# EAGLE design solenoid (EAGLE 9.6.2)
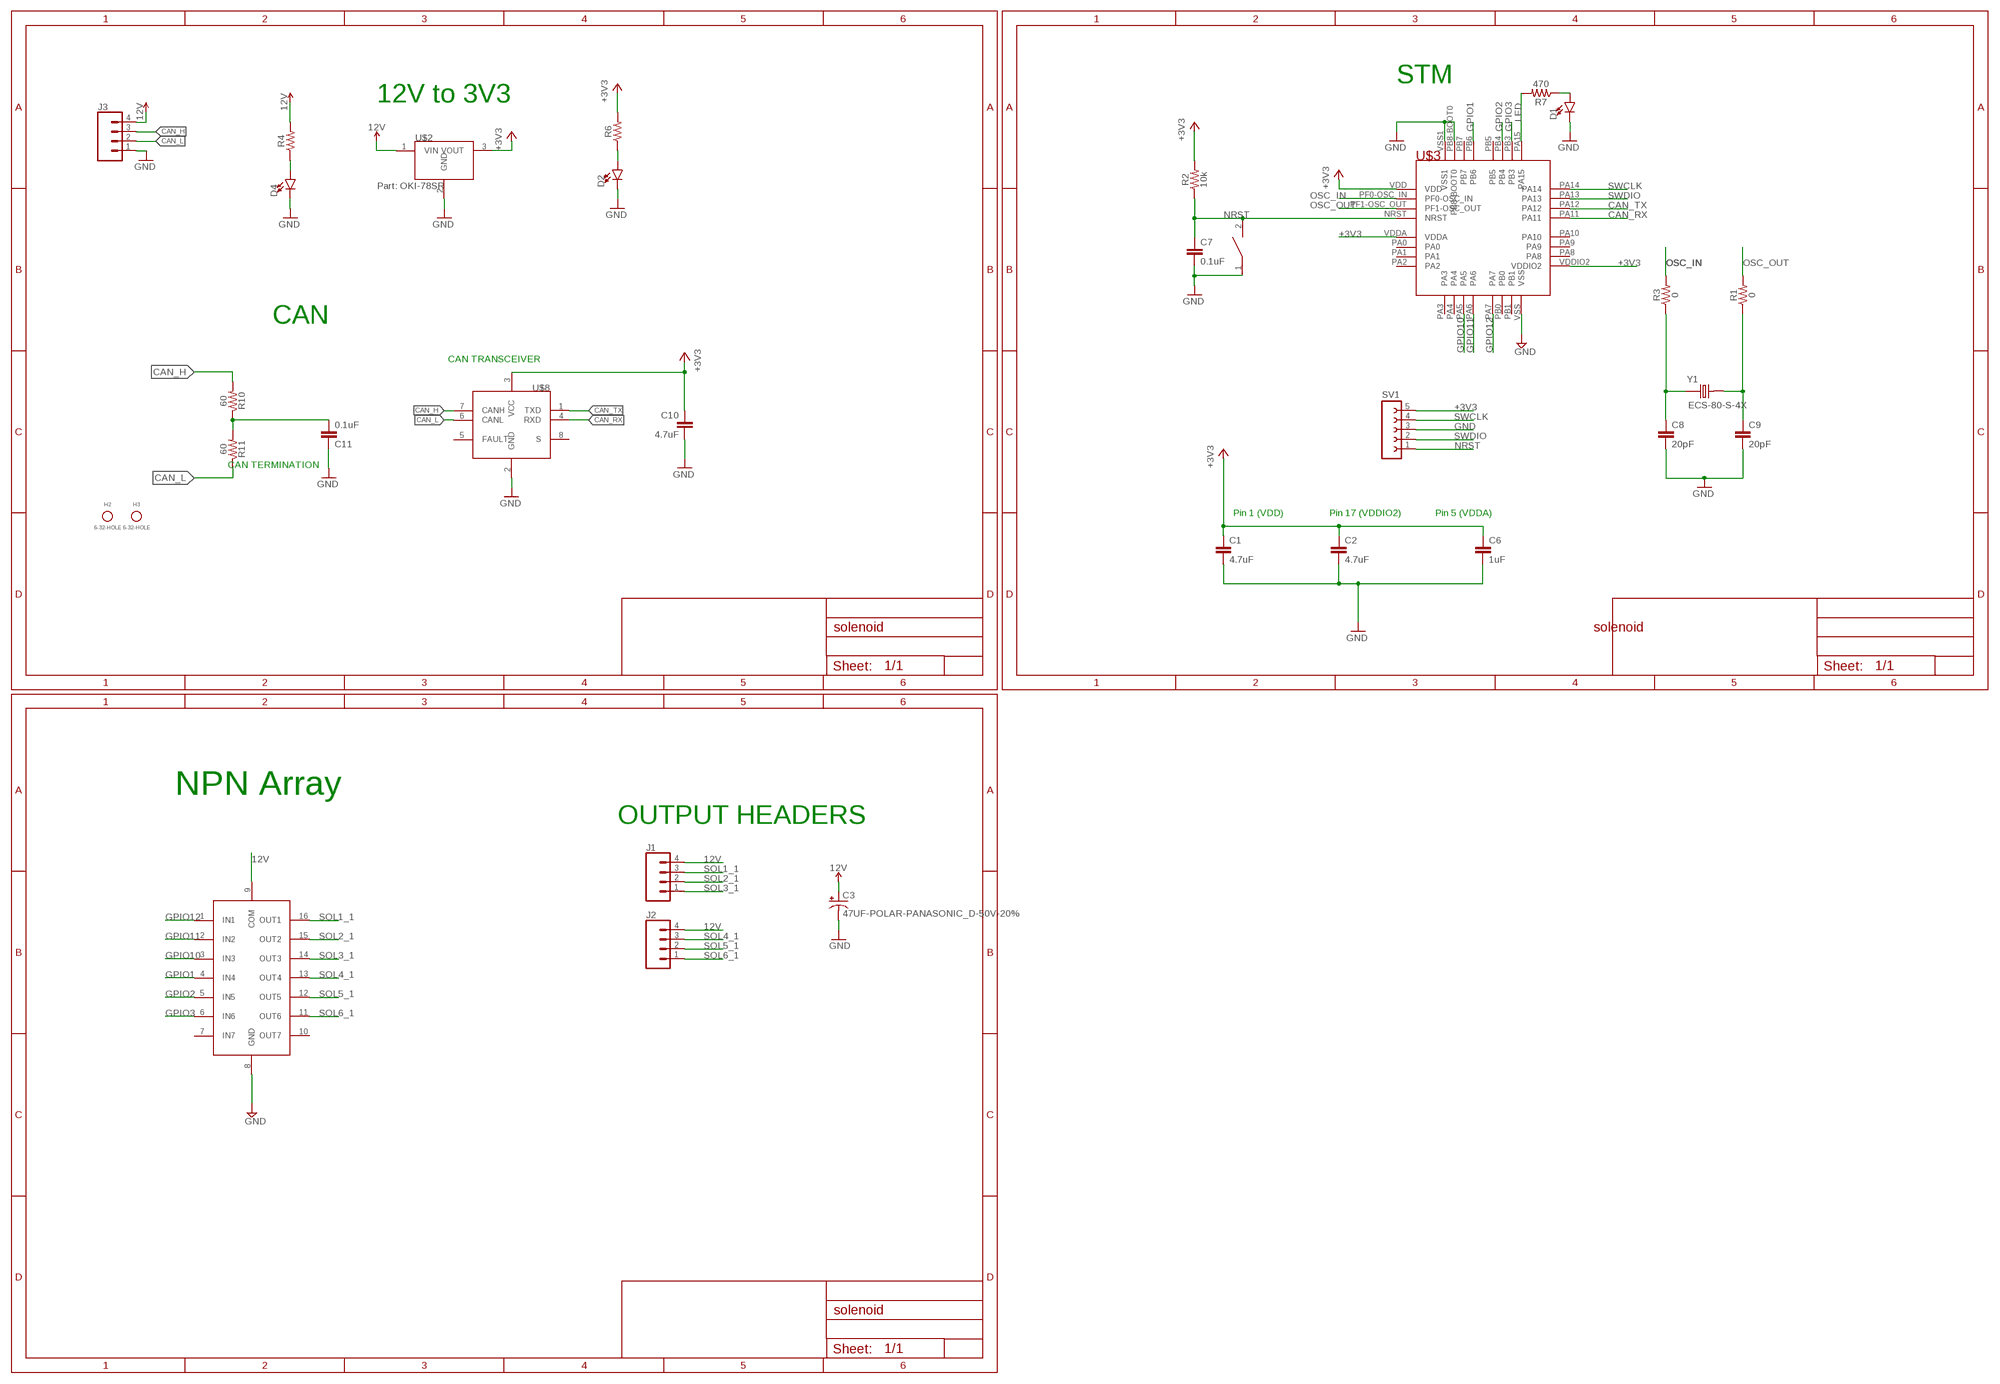
[diagram p0: schematic, sheet 1]

## Parts
C1  4.7uF  4.7UF0603  [0603]
C2  4.7uF  4.7UF0603  [0603]
C3  47UF-POLAR-PANASONIC_D-50V-20%  [PANASONIC_D]
C6  1uF  4.7UF0603  [0603]
C7  0.1uF  4.7UF0603  [0603]
C8  20pF  4.7UF0603  [0603]
C9  20pF  4.7UF0603  [0603]
C10  4.7uF  4.7UF0603  [0603]
C11  0.1uF  0.1UF-0603-25V-(+80/-20%)  [0603]
D1  LED0603  [LED-0603]
D2  LED0603  [LED-0603]
D4  LED0603  [LED-0603]
H2  6-32-HOLE  [6-32-HOLE]
H3  6-32-HOLE  [6-32-HOLE]
J1  PXC-PTSM-04-V-1778573  [PXC-PTSM-04-V-1778573]
J2  PXC-PTSM-04-V-1778573  [PXC-PTSM-04-V-1778573]
J3  PXC-PTSM-04-V-1778573  [PXC-PTSM-04-V-1778573]
R1  0  1KOHM-0603-1/10W-1%  [0603]
R2  10k  1KOHM-0603-1/10W-1%  [0603]
R3  0  1KOHM-0603-1/10W-1%  [0603]
R4  RESISTOR0603  [0603]
R6  RESISTOR0603  [0603]
R7  470  RESISTOR0603  [0603]
R10  60  1KOHM-0603-1/10W-1%  [0603]
R11  60  1KOHM-0603-1/10W-1%  [0603]
SV1  FE05-1  [FE05-1]
U1  ULN2003V12  [ULN2003V12]
U$1  DISCRETECOMPONENTS_SWITCH  [DISCRETECOMPONENTS_SW_2512]
U$2  MURATA-DC-DC  [MURATA-DC-DC]
U$3  STM32F042K6T6  [STM32F042K6T6]
U$8  TCAN337D  [SOIC-8]
Y1  ECS-80-S-4X  [XTAL_ECS-80-S-4X]

## Nets
12V: C3.+ J1.4 J2.4 J3.4 R4.2 U1.9(COM) U$2.1(VIN)
+3V3: C1.1 C2.1 C6.1 C10.1 R2.2 R6.2 SV1.5 U$2.3(VOUT) U$3.VDD U$3.VDDA U$3.VDDIO2 U$8.3(VCC)
CAN_H: J3.3 R10.2 U$8.7(CANH)
CAN_L: J3.2 R11.1 U$8.6(CANL)
CAN_RX: U$3.PA11 U$8.4(RXD)
CAN_TX: U$3.PA12 U$8.1(TXD)
GND: C1.2 C2.2 C3.- C6.2 C7.2 C8.2 C9.2 C10.2 C11.1 D1.C D2.C D4.C J3.1 SV1.3 U1.8(GND) U$1.1 U$2.2(GND) U$3.PB8-BOOT0 U$3.VSS U$3.VSS1 U$8.2(GND)
GPIO1: U1.4(IN4) U$3.PB6
GPIO2: U1.5(IN5) U$3.PB4
GPIO3: U1.6(IN6) U$3.PB3
GPIO10: U1.3(IN3) U$3.PA5
GPIO11: U1.2(IN2) U$3.PA6
GPIO12: U1.1(IN1) U$3.PA7
LED: R7.2 U$3.PA15
N$1: C9.1 R1.1 Y1.2
N$2: C8.1 R3.1 Y1.1
N$5: C11.2 R10.1 R11.2
N$24: D1.A R7.1
N$25: D4.A R4.1
N$27: D2.A R6.1
NRST: C7.1 R2.1 SV1.1 U$1.2 U$3.NRST
OSC_IN: R3.2 U$3.PF0-OSC_IN
OSC_OUT: R1.2 U$3.PF1-OSC_OUT
SOL1_1: J1.3 U1.16(OUT1)
SOL2_1: J1.2 U1.15(OUT2)
SOL3_1: J1.1 U1.14(OUT3)
SOL4_1: J2.3 U1.13(OUT4)
SOL5_1: J2.2 U1.12(OUT5)
SOL6_1: J2.1 U1.11(OUT6)
SWCLK: SV1.4 U$3.PA14
SWDIO: SV1.2 U$3.PA13
Unconnected: U1.7(IN7) U1.10(OUT7) U$3.PA0 U$3.PA1 U$3.PA2 U$3.PA3 U$3.PA4 U$3.PA8 U$3.PA9 U$3.PA10 U$3.PB0 U$3.PB1 U$3.PB5 U$3.PB7 U$8.5(FAULT) U$8.8(S)

## Notes on the sheet
- STM
- 12V to 3V3
- CAN
- CAN TRANSCEIVER
- CAN TERMINATION
- Pin 1 (VDD) | Pin 17 (VDDIO2) | Pin 5 (VDDA)
- NPN Array
- OUTPUT HEADERS

## Library data of the parts
C1 C2 C10 = SparkFun-Capacitors:4.7UF: 4.7µF ceramic capacitors A capacitor is a passive two-terminal electrical component used to store electrical energy temporarily in an electric field.; PROD_ID: CAP-08280
C3 = Panasonic 47 uF cap - EEE-1CA470SP:47UF-POLAR: 47µF polarized capacitors A capacitor is a passive two-terminal electrical component used to store electrical energy temporarily in an electric field.
C6-C9 = SparkFun-Capacitors:4.7UF: 4.7µF ceramic capacitors A capacitor is a passive two-terminal electrical component used to store electrical energy temporarily in an electric field.; PROD_ID: CAP-08280; VALUE: 4.7uF
C11 = SparkFun-Capacitors:0.1UF: 0.1µF ceramic capacitors A capacitor is a passive two-terminal electrical component used to store electrical energy temporarily in an electric field.; PROD_ID: CAP-00810
D1 D2 D4 = SparkFun-LED:LED: LED (Generic) Standard schematic elements and footprints for 5mm, 3mm, 1206, and 0603 sized LEDs. Generic LEDs with no color specified.
H2 H3 = Mounting Holes:6-32-HOLE
J1-J3 = Phoenix Contact PTSM-04-V-1778573:PXC-PTSM-04-V-1778573
R1-R3 R10 R11 = SparkFun-Resistors:1KOHM: 1kΩ resistor A resistor is a passive two-terminal electrical component that implements electrical resistance as a circuit element. Resistors act to reduce current flow, and, at the same time, act to lower voltage levels within circuits. - Wikipedia; PROD_ID: RES-07856; VALUE: 1k
R4 R6 R7 = SparkFun-Resistors:RESISTOR: Generic Resistor Package
SV1 = con-lsta:FE05-1: FEMALE HEADER; OC_FARNELL: unknown; OC_NEWARK: unknown
U1 = ULN2003V12:ULN2003V12; A1_MIN: 0.25; A_MAX: 1.75; A_MIN: 1.75; A_NOM: 1.75; B_MAX: 0.51; B_MIN: 0.33; B_NOM: 0.42; D2_MAX: 0.0; D_MAX: 10.0; D_MIN: 9.8; D_NOM: 9.9; E1_MAX: 4.0; E1_MIN: 3.8; E1_NOM: 3.9; E2_MAX: 0.0; ENOM: 1.27; E_MAX: 6.2; E_MIN: 5.8; E_NOM: 6.0; L_MAX: 1.27; L_MIN: 0.38; L_NOM: 0.825; MANUFACTURER: Diodes Inc.; PIN_COUNT: 16.0; SNAPEDA_PACKAGE_ID: 27538; STANDARD: IPC 7351B
U$1 = Push button - FSM2JMTR:DISCRETECOMPONENTS_SWITCH
U$2 = MURATA_3pin_dcdc:MURATA-DC-DC
U$3 = PI_Shield_Library:STM32F042K6T6
U$8 = STM and CAN parts:TCAN337D
Y1 = ECS-80-S-4X:ECS-80-S-4X: CRYSTAL T/H; DESCRIPTION: Crystal 8MHz Series 2-Pin HC-49/U; DIGI-KEY_PART_NUMBER: X1057-ND; DIGI-KEY_PURCHASE_URL: https://www.digikey.com/product-detail/en/ecs-inc/ECS-80-S-4X/X1057-ND/827549?utm_source=snapeda&utm_medium=aggregator&utm_campaign=symbol; MF: ECS International; MP: ECS-80-S-4X; PACKAGE: HC-49/US ECS International

## Board
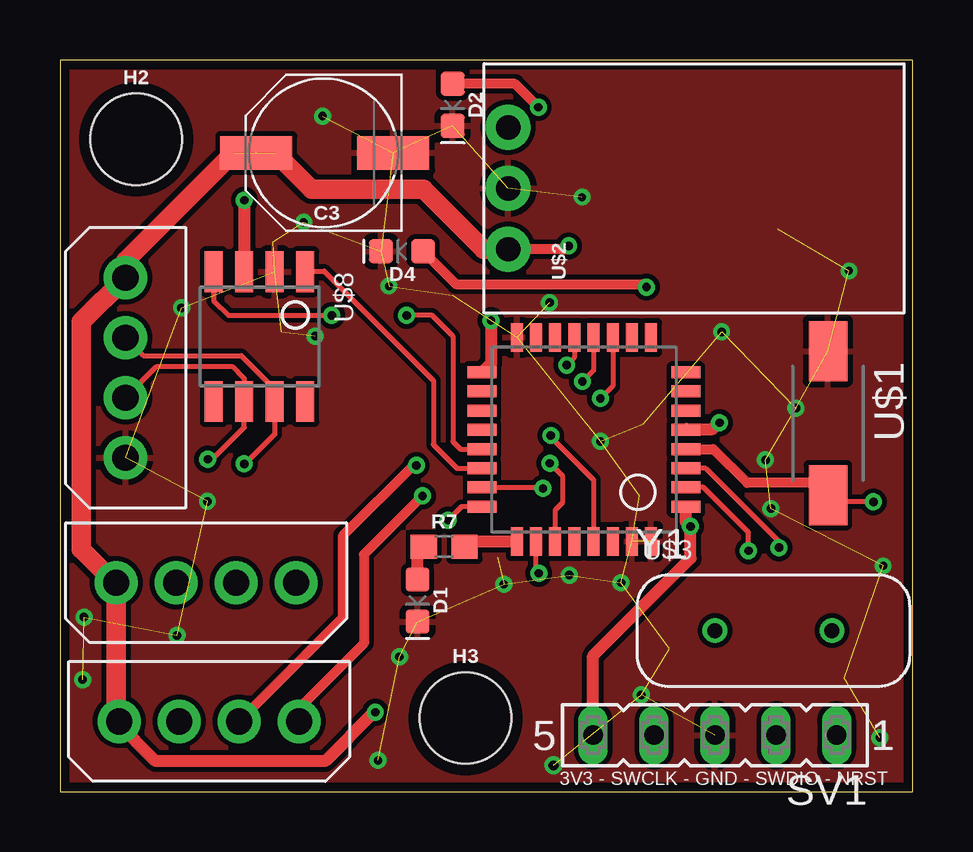
[diagram p1: board, top side]
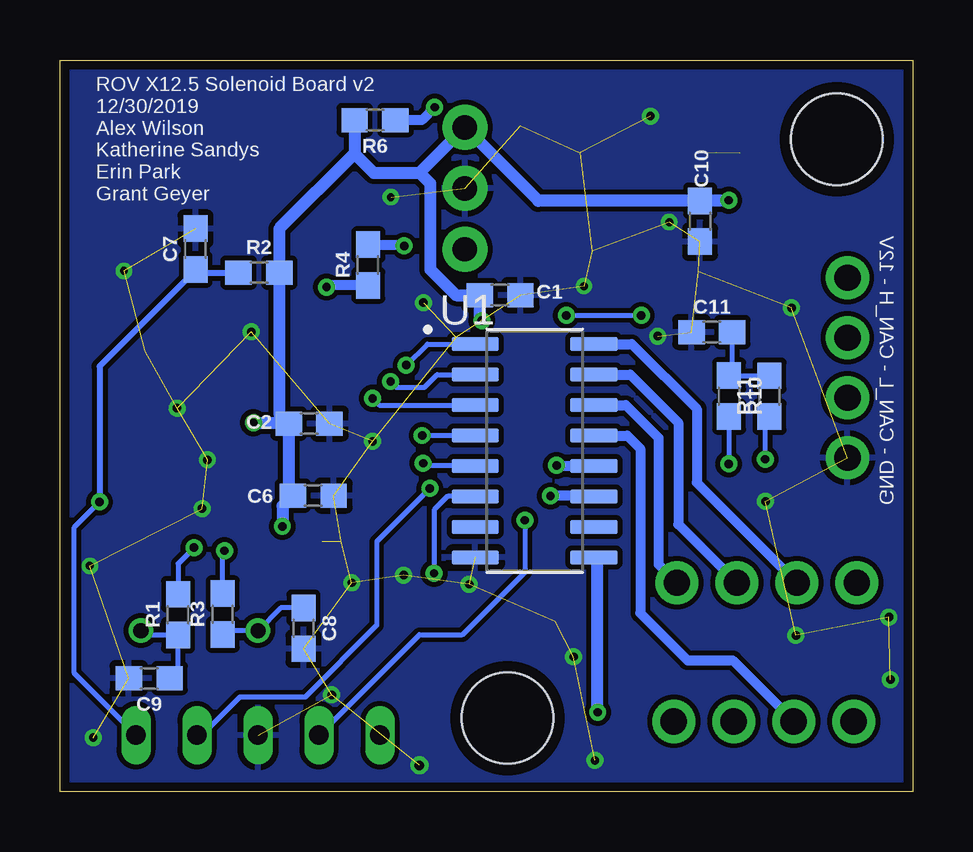
[diagram p2: board, bottom side, seen from below]

Size 35.56 x 30.48 mm. Coordinates in mm from the lower left corner, seen from the top.
Outline: 0,0 35.56,0 35.56,30.48 0,30.48 0,0
Copper layers (1*16): Top 0.0356mm / dielectric 1.5011mm / Bottom 0.0356mm
Design rules "ECE_Senior_Design": minimum track width 8mil, minimum drill 13mil, track to track 8mil, track to pad 8mil, pad to pad 6mil, via to via 8mil, smd to smd 6mil, copper to edge 15mil, drill to drill 8mil, minimum pad ring 7mil, minimum via ring 7mil, stop-mask expansion 3mil, vias tented up to drill 0mil, thermal gap 10mil

### Footprints (pad centres in the part's own frame; a part is rotated, then mirrored left to right if it is on the bottom)
0603 = smd 1.1 x 1: 1 -0.85,0; 2 0.85,0
PANASONIC_D = smd 3 x 1.4: + 2.8,0; - -2.9,0
LED-0603 = smd 1 x 1: A -0.877,0; C 0.877,0
6-32-HOLE = hole 3.81: 0,0
PXC-PTSM-04-V-1778573 = drill 1.1 pad 1.8: 1 0,0; 2 2.5,0; 3 5,0; 4 7.5,0
FE05-1 = drill 0.813 long: 1 -5.08,0; 2 -2.54,0; 3 0,0; 4 2.54,0; 5 5.08,0
ULN2003V12 = smd 1.97 x 0.6: 1 -2.475,4.445; 2 -2.475,3.175; 3 -2.475,1.905; 4 -2.475,0.635; 5 -2.475,-0.635; 6 -2.475,-1.905; 7 -2.475,-3.175; 8 -2.475,-4.445; 9 2.475,-4.445; 10 2.475,-3.175; 11 2.475,-1.905; 12 2.475,-0.635; 13 2.475,0.635; 14 2.475,1.905; 15 2.475,3.175; 16 2.475,4.445
DISCRETECOMPONENTS_SW_2512 = smd 2.5 x 1.6: 1 -3,0; 2 3,0
MURATA-DC-DC = drill 1.016 pad 1.88: 1 -2.54,0; 2 0,0; 3 2.54,0
STM32F042K6T6 = smd 1.2 x 0.5: NRST 0,3.2; PA0 0,1.6; PA1 0,0.8; PA2 0,0; PA8 8.5,0.8; PA9 8.5,1.6; PA10 8.5,2.4; PA11 8.5,3.2; PA12 8.5,4; PA13 8.5,4.8; PA14 8.5,5.6; PF0-OSC_IN 0,4.8; PF1-OSC_OUT 0,4; VDD 0,5.6; VDDA 0,2.4; VDDIO2 8.5,0 | smd 0.5 x 1.2: PA3 1.45,-1.45; PA4 2.25,-1.45; PA5 3.05,-1.45; PA6 3.85,-1.45; PA7 4.65,-1.45; PA15 7.05,7.05; PB0 5.45,-1.45; PB1 6.25,-1.45; PB3 6.25,7.05; PB4 5.45,7.05; PB5 4.65,7.05; PB6 3.85,7.05; PB7 3.05,7.05; PB8-BOOT0 2.25,7.05; VSS 7.05,-1.45; VSS1 1.45,7.05
SOIC-8 = smd 1.7 x 0.75: 1 0,3.81; 2 0,2.54; 3 0,1.27; 4 0,0; 5 5.4,0; 6 5.4,1.27; 7 5.4,2.54; 8 5.4,3.81
XTAL_ECS-80-S-4X = drill 0.63 pad 1.03: 1 -2.44,0; 2 2.44,0

### Placement (x,y rotation side)
C1  17.21,20.68 0 bottom
C2  25.18,15.33 0 bottom
C3  10.99,26.61 180 top
C6  25,12.32 0 bottom
C7  29.91,22.6 90 bottom
C8  25.41,6.8 270 bottom
C9  31.84,4.72 180 bottom
C10  8.88,23.76 270 bottom
C11  8.38,19.14 0 bottom
D1  14.91,7.96 270 top
D2  16.37,28.61 270 top
D4  14.26,22.51 180 top
H2  3.17,27.18 0 top
H3  16.9,3.06 0 top
J1  9.84,8.7 180 top
J2  9.97,2.92 180 top
J3  2.73,13.91 90 top
R1  30.64,7.37 90 bottom
R2  27.26,21.62 0 bottom
R3  28.77,7.39 90 bottom
R4  22.71,21.94 90 bottom
R6  22.43,27.98 180 bottom
R7  16.01,10.19 0 top
R10  7.67,16.48 270 bottom
R11  5.98,16.47 90 bottom
SV1  27.3,2.35 180 top
U1  15.77,14.2 0 bottom
U$1  32.02,15.35 270 top
U$2  18.68,25.13 90 top
U$3  26.09,17.47 180 top
U$8  6.41,21.65 270 top
Y1  29.74,6.7 0 top

### Tracks (layer width: path | path; a pad name or v marks a point on that pad's centre or on a via)
12V  (via drill 0.35)  (2 unrouted)
  Top 0.203: v21.21,22.73 21.07,22.59
  Top 0.406: 21.07,22.59 U$2.1
  Top 0.508: v13.14,3.3 13.08,3.3 11.05,1.27 3.99,1.27 2.34,2.92 2.34,3.05
  Top 0.813: U$2.1 17.67,22.59 15.16,25.09 10.49,25.09 8.99,26.59 | 7.21,26.59 2.73,22.11 J3.4 0.89,19.57 0.89,10.09 2.28,8.7 J1.4 2.34,3.05 J2.4
  Bottom 0.406: R4.2 21.26,22.79 v21.21,22.73
  Bottom 0.508: v13.14,3.3 13.14,9.6 U1.9
+3V3  (via drill 0.35)
  Top 0.508: v17.97,19.62 17.97,17.85 U$3.VDDIO2 | U$3.VDD 26.09,11.24 v26.29,11.05 26.29,9.72 22.23,5.65 SV1.5 | U$3.VDDA 26.12,15.1 27.2,15.1 27.47,15.37 v27.5,15.37 | v7.68,24.64 U$8.3
  Bottom 0.508: R6.2 23.28,26.58 | 20.57,25.78 22.48,25.78 23.28,26.58 | 20.57,25.78 20.13,25.34 20.13,21.76 19.05,20.68 C1.1 18.06,19.71 v17.97,19.62 | 23.28,26.58 26.41,23.44 R2.2 26.41,15.72 C2.1 | 20.57,25.78 U$2.3 15.62,24.61 C10.1 7.68,24.61 v7.68,24.64 | C2.1 26.02,12.5 C6.1 26.29,11.89 v26.29,11.05 | v27.5,15.37 26.06,15.37 C2.1
CAN_H  (via drill 0.35)
  Top 0.203: v7.68,13.65 7.72,13.65 8.95,14.88 U$8.7 8.95,16.76 7.56,18.16 3.48,18.16 J3.3
  Bottom 0.203: R10.2 7.68,15.61 v7.68,13.65
CAN_L  (via drill 0.35)
  Top 0.203: 6.2,13.84 v6.16,13.84 6.35,13.84 7.68,15.18 U$8.6 7.68,17.21 7.18,17.72 4.04,17.72 J3.2
  Bottom 0.203: v6.16,13.84 6.16,15.44 R11.1
CAN_RX  (via drill 0.35)
  Top 0.203: v11.33,19.84 7.02,19.84 6.41,20.45 U$8.4 | v14.45,19.84 15.52,19.84 16.38,18.97 16.38,14.58 16.69,14.27 U$3.PA11
  Bottom 0.203: v14.45,19.84 v11.33,19.84
CAN_TX
  Top 0.203: U$3.PA12 16.55,13.47 15.57,14.45 15.57,17.12 11.01,21.68 10.25,21.68 U$8.1
GND  (via drill 0.33, 0.35, 0.4)  (46 unrouted)
  other vias: 29.64,11.79 27.58,19.15 20.41,20.37 21.23,9.02 29.41,13.82 10.95,28.14 10.64,18.97 22.53,14.59 14.15,5.61 30.68,15.98 34.18,2.25 24.23,4.03 34.32,9.4 20.57,1.09 21.77,24.77 13.72,21.06 23.39,8.7 4.88,6.5 6.15,12.09 5.07,20.15 32.89,21.69 18.5,8.64 13.26,1.3 1,7.26 0.94,4.66 10.16,23.72
  pour Bottom (isolate 0.152): -0.76,30.84 -0.76,-0.3 36.4,-0.3 36.4,30.84
  pour Top (isolate 0.152): -2.04,32.89 -2.04,-2.36 36.58,-2.36 37.52,-1.42 37.52,31.37 35.99,32.89
GPIO1  (via drill 0.35)
  Top 0.203: v20.46,14.83 20.46,14.77 22.24,12.99 U$3.PB6
  Bottom 0.203: U1.4 v20.46,14.83
GPIO2  (via drill 0.35)
  Top 0.203: v20.42,13.68 20.94,13.16 20.94,12.03 20.64,11.73 U$3.PB4
  Bottom 0.203: U1.5 20.31,13.56 v20.42,13.68
GPIO3  (via drill 0.35)
  Top 0.203: v19.96,9.09 19.84,9.22 U$3.PB3
  Top 0.406: U$3.PB3
  Bottom 0.203: U1.6 19.41,12.29 19.96,11.73 v19.96,9.09
GPIO10  (via drill 0.35)
  Top 0.203: U$3.PA5 23.04,16.9 v22.53,16.38
  Bottom 0.203: v22.53,16.38 22.25,16.1 U1.3
GPIO11  (via drill 0.35)
  Top 0.203: U$3.PA6 22.24,17.55 v21.78,17.08
  Bottom 0.203: v21.78,17.08 21.54,16.84 20.37,16.84 19.84,17.37 U1.2
GPIO12  (via drill 0.35)
  Top 0.203: U$3.PA7 21.44,18.08 v21.12,17.76
  Bottom 0.203: v21.12,17.76 20.25,18.64 U1.1
LED
  Top 0.508: R7.2 17.09,10.42 U$3.PA15
N$1
  Bottom 0.203: Y1.2 32,6.52 R1.1 30.64,5.08 C9.1
N$2
  Bottom 0.203: C8.1 26.36,7.65 Y1.1 28.61,6.7 R3.1
N$5
  Bottom 0.203: R11.2 R10.1 7.53,17.47 C11.2
N$24
  Top 0.508: D1.A 14.91,9.94 R7.1
N$25  (via drill 0.35)
  Top 0.406: D4.A 15.14,22.51 16.51,21.14 24.32,21.14 v24.45,21.02
  Bottom 0.203: 24.38,21.09 v24.45,21.02
  Bottom 0.406: R4.1 24.38,21.09
N$27  (via drill 0.35)
  Top 0.406: D2.A 18.96,29.49 v19.94,28.51
  Bottom 0.406: v19.94,28.51 20.47,27.98 R6.1
NRST  (via drill 0.35)
  Top 0.203: v33.91,12.06 32.31,12.06 31.84,12.53
  Top 0.406: U$3.NRST 27.23,14.27 28.65,12.86 31.52,12.86 31.84,12.53 U$1.2
  Bottom 0.203: SV1.1 34.96,4.93 34.96,11.01 v33.91,12.06
  Bottom 0.254: v33.91,12.06 33.91,17.72 29.91,21.71 C7.1 29.78,21.62 R2.1
OSC_IN  (via drill 0.35)
  Top 0.203: v28.7,10.03 28.7,10.79 26.83,12.67 U$3.PF0-OSC_IN
  Bottom 0.203: R3.2 28.77,9.96 v28.7,10.03
OSC_OUT  (via drill 0.35)
  Top 0.203: U$3.PF1-OSC_OUT 26.92,13.47 29.97,10.42 v29.97,10.16
  Bottom 0.203: v29.97,10.16 30.64,9.5 R1.2
SOL1_1
  Bottom 0.406: U1.16 11.72,18.64 9.02,15.94 9.02,12.87 J1.3
SOL2_1
  Bottom 0.406: U1.15 11.79,17.37 9.78,15.37 9.78,11.14 J1.2
SOL3_1
  Bottom 0.406: U1.14 11.98,16.1 11.24,15.37 10.6,14.73 10.6,9.46 J1.1
SOL4_1
  Bottom 0.406: U1.13 11.91,14.83 11.37,14.29 11.37,7.43 9.4,5.46 7.51,5.46 J2.3
SOL5_1  (via drill 0.35)
  Top 0.406: J2.2 11.81,7.26 11.81,10.67 14.73,13.59 v14.86,13.59
  Bottom 0.406: v14.86,13.59 14.83,13.56 U1.12
SOL6_1  (via drill 0.35)
  Top 0.406: v15.11,12.32 12.68,9.88 12.68,6.18 9.97,3.48 J2.1
  Bottom 0.406: U1.11 13.32,12.32 v15.11,12.32
SWCLK  (via drill 0.35)
  Top 0.203: U$3.PA14 16.75,11.87 v16.18,11.3
  Bottom 0.203: v16.18,11.3 16.18,9.14 18.78,6.54 20.57,6.54 SV1.4
SWDIO  (via drill 0.35)
  Top 0.203: U$3.PA13 20.1,12.67 v20.14,12.63
  Bottom 0.203: v20.14,12.63 22.35,10.42 22.35,6.92 25.34,3.94 28.07,3.94 29.65,2.35 SV1.2

### Text on the board
tNames: 3V3 - SWCLK - GND - SWDIO - NRST
bNames: ROV X12.5 Solenoid Board v2 / 12/30/2019 / Alex Wilson / Katherine Sandys / Erin Park / Grant Geyer | GND - CAN_L - CAN_H - 12V